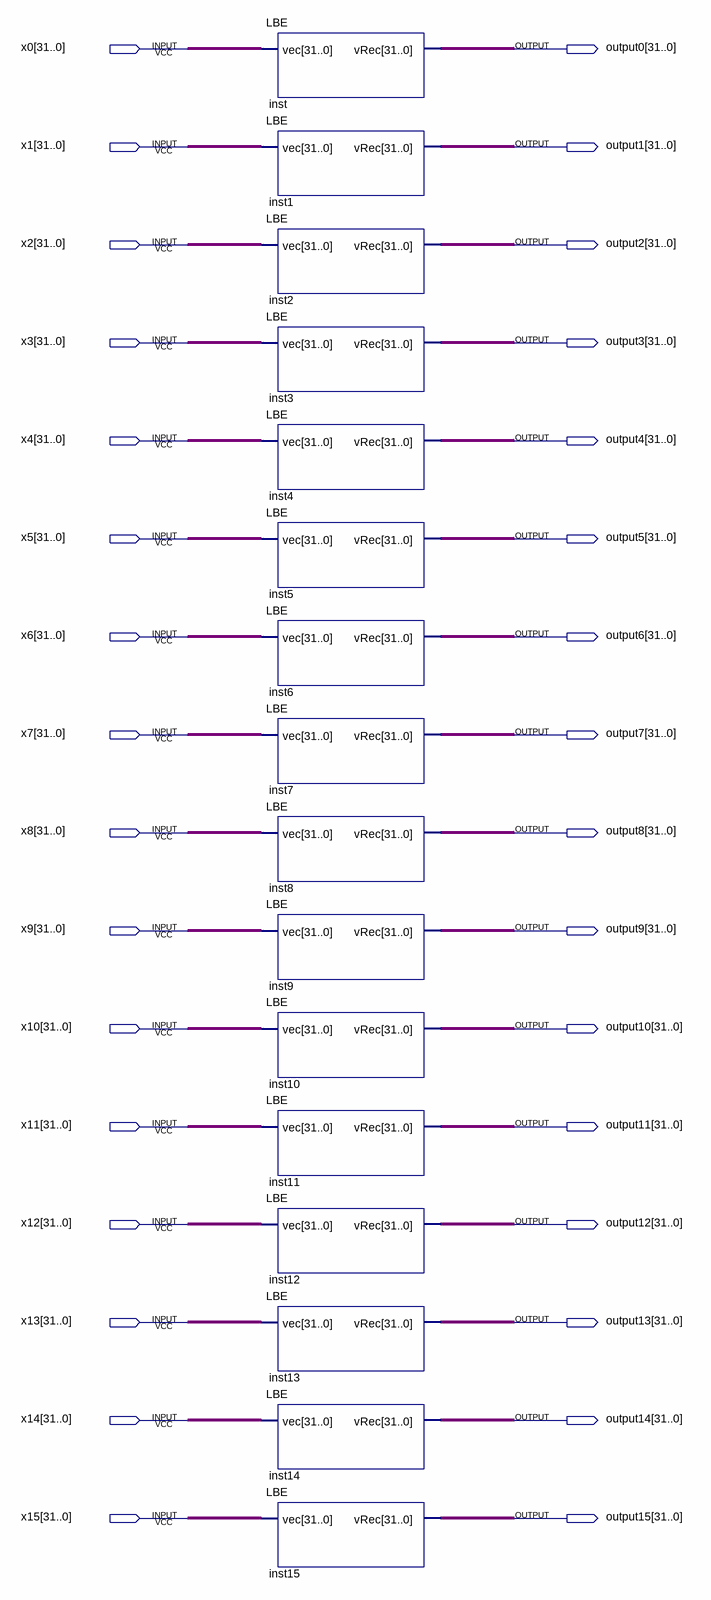
[diagram p0: schematic sheet]
// Quartus schematic full_LBE.bdf as structural Verilog: 16 symbols, 32 pins
module full_LBE (
  input  [31:0] x0,
  input  [31:0] x1,
  input  [31:0] x2,
  input  [31:0] x3,
  input  [31:0] x4,
  input  [31:0] x5,
  input  [31:0] x6,
  input  [31:0] x7,
  input  [31:0] x8,
  input  [31:0] x9,
  input  [31:0] x10,
  input  [31:0] x11,
  input  [31:0] x12,
  input  [31:0] x13,
  input  [31:0] x14,
  input  [31:0] x15,
  output [31:0] output0,
  output [31:0] output1,
  output [31:0] output2,
  output [31:0] output3,
  output [31:0] output4,
  output [31:0] output5,
  output [31:0] output6,
  output [31:0] output7,
  output [31:0] output8,
  output [31:0] output9,
  output [31:0] output10,
  output [31:0] output11,
  output [31:0] output12,
  output [31:0] output13,
  output [31:0] output14,
  output [31:0] output15
);

  LBE inst (.vec(x0), .vRec(output0));
  LBE inst1 (.vec(x1), .vRec(output1));
  LBE inst2 (.vec(x2), .vRec(output2));
  LBE inst3 (.vec(x3), .vRec(output3));
  LBE inst4 (.vec(x4), .vRec(output4));
  LBE inst5 (.vec(x5), .vRec(output5));
  LBE inst6 (.vec(x6), .vRec(output6));
  LBE inst7 (.vec(x7), .vRec(output7));
  LBE inst8 (.vec(x8), .vRec(output8));
  LBE inst9 (.vec(x9), .vRec(output9));
  LBE inst10 (.vec(x10), .vRec(output10));
  LBE inst11 (.vec(x11), .vRec(output11));
  LBE inst12 (.vec(x12), .vRec(output12));
  LBE inst13 (.vec(x13), .vRec(output13));
  LBE inst14 (.vec(x14), .vRec(output14));
  LBE inst15 (.vec(x15), .vRec(output15));
endmodule
